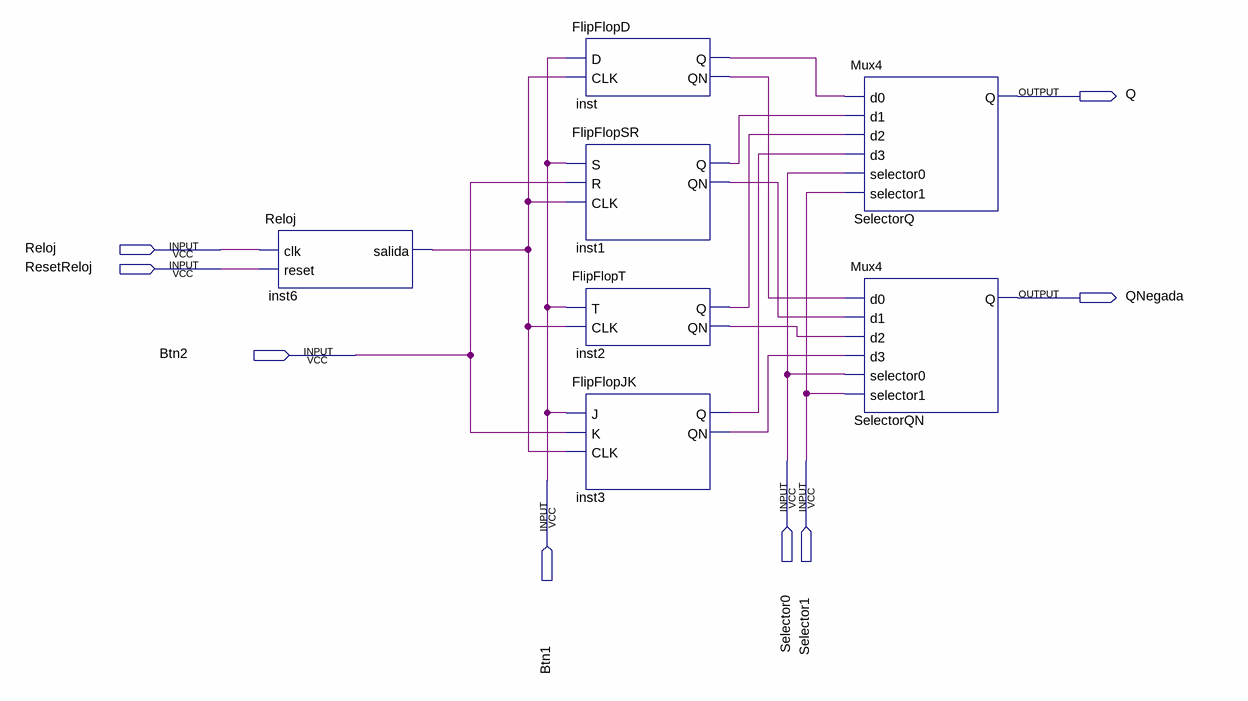
[diagram p0: schematic sheet]
// Quartus schematic Prac1.bdf as structural Verilog: 7 symbols, 8 pins
module Prac1 (
  input  Reloj,
  input  ResetReloj,
  input  Btn2,
  input  Selector0,
  input  Selector1,
  input  Btn1,
  output Q,
  output QNegada
);

  wire inst1_q, inst1_qn, inst2_q, inst2_qn, inst3_q, inst3_qn, inst6_salida, inst_q, inst_qn;

  Reloj inst6 (.clk(Reloj), .reset(ResetReloj), .salida(inst6_salida));
  FlipFlopD inst (.D(Btn1), .CLK(inst6_salida), .Q(inst_q), .QN(inst_qn));
  FlipFlopSR inst1 (.S(Btn1), .R(Btn2), .CLK(inst6_salida), .Q(inst1_q), .QN(inst1_qn));
  FlipFlopT inst2 (.T(Btn1), .CLK(inst6_salida), .Q(inst2_q), .QN(inst2_qn));
  FlipFlopJK inst3 (.J(Btn1), .K(Btn2), .CLK(inst6_salida), .Q(inst3_q), .QN(inst3_qn));
  Mux4 SelectorQ (
    .d0(inst_q), .d1(inst1_q), .d2(inst2_q), .d3(inst3_q), .selector0(Selector0), .selector1(Selector1), .Q(Q));
  Mux4 SelectorQN (
    .d0(inst_qn), .d1(inst1_qn), .d2(inst2_qn), .d3(inst3_qn), .selector0(Selector0), .selector1(Selector1),
    .Q(QNegada));
endmodule
